# EAGLE design ai_hub_usb (EAGLE 8.3.0)
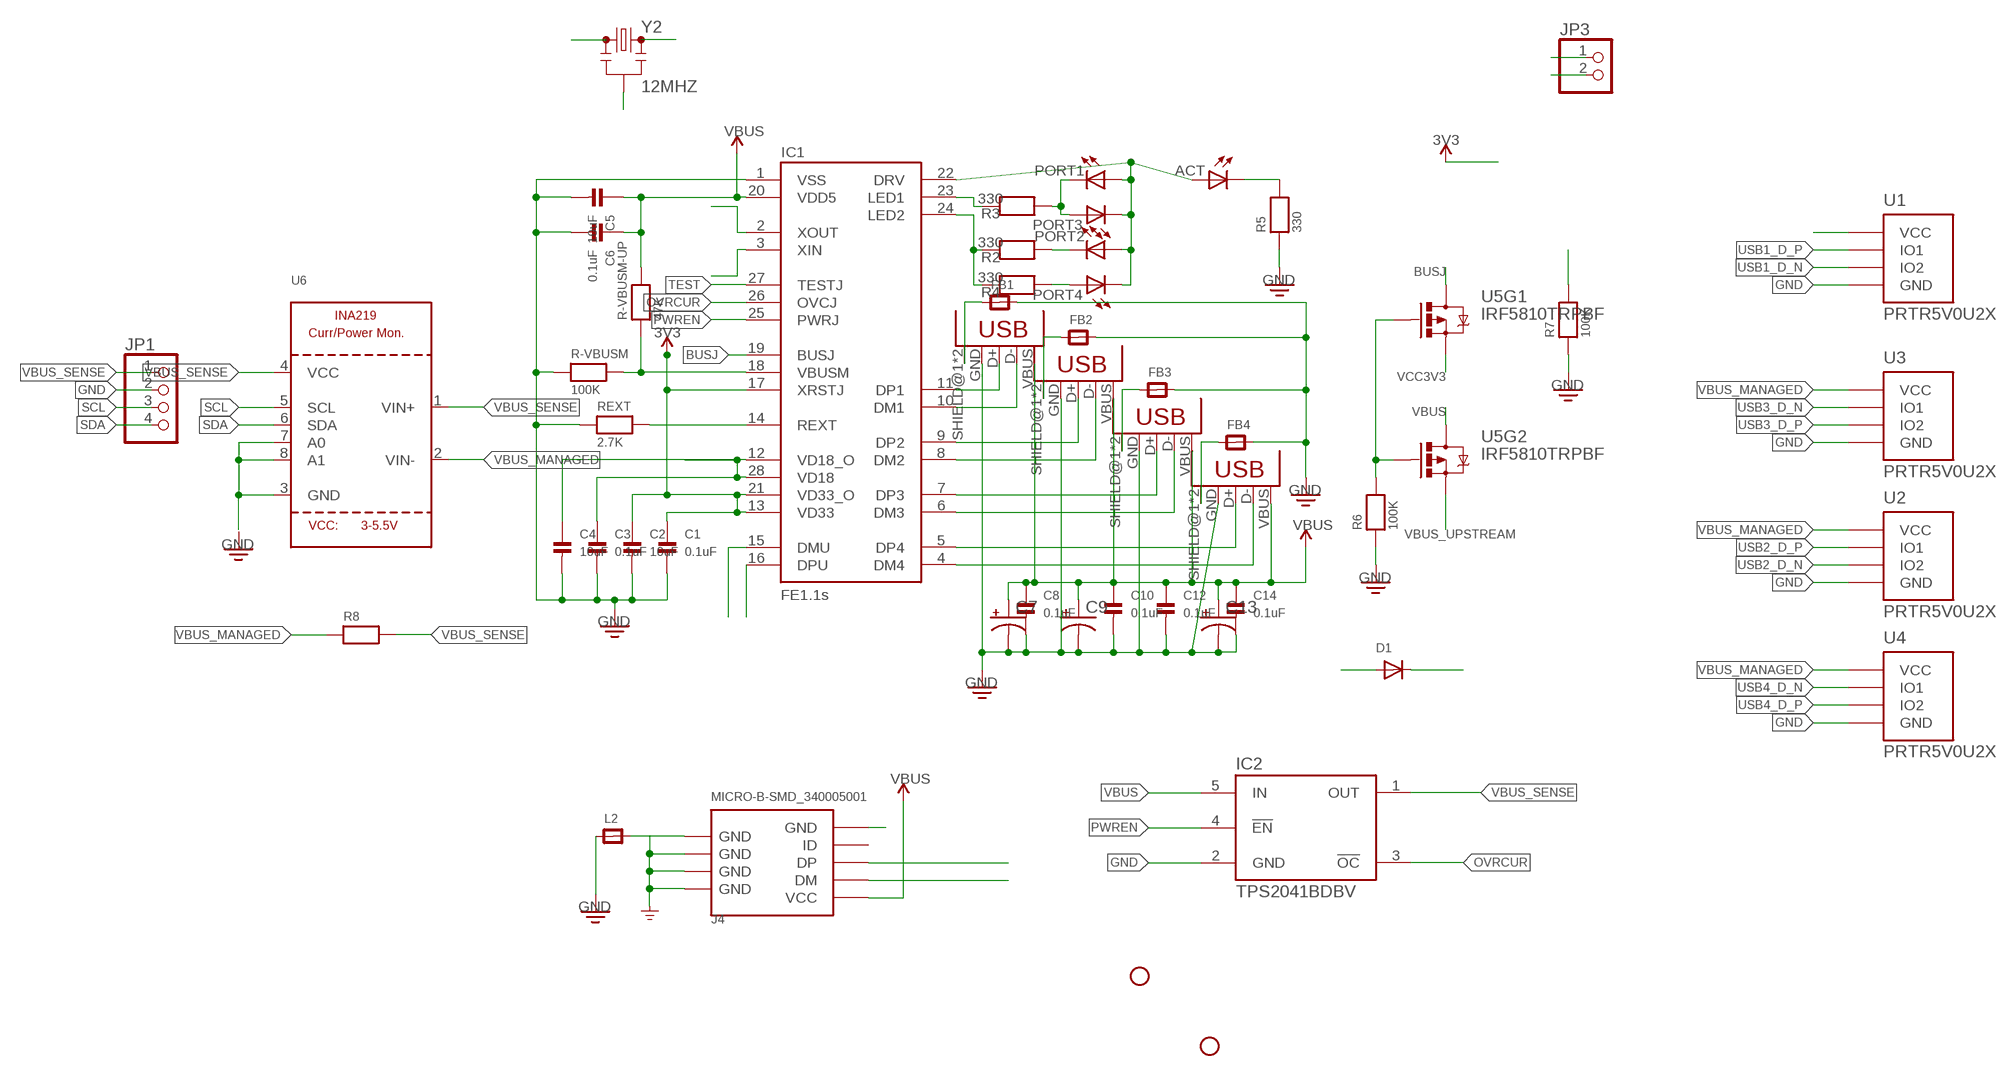
[diagram p0: schematic, sheet 1]

## Parts
ACT  LED0603  [LED-0603]
C1  0.1uF  CAP_CERAMIC_0603MP  [_0603MP]
C2  10uF  CAP_CERAMIC_0603MP  [_0603MP]
C3  0.1uF  CAP_CERAMIC_0603MP  [_0603MP]
C4  10uF  CAP_CERAMIC_0603MP  [_0603MP]
C5  10uF  CAP_CERAMIC_0603MP  [_0603MP]
C6  0.1uF  CAP_CERAMIC_0603MP  [_0603MP]
C7  CAP_POLD  [PANASONIC_D]
C8  0.1uF  CAP_CERAMIC_0603MP  [_0603MP]
C9  CAP_POLD  [PANASONIC_D]
C10  0.1uF  CAP_CERAMIC_0603MP  [_0603MP]
C12  0.1uF  CAP_CERAMIC_0603MP  [_0603MP]
C13  CAP_POLD  [PANASONIC_D]
C14  0.1uF  CAP_CERAMIC_0603MP  [_0603MP]
D1  DIODESMA  [SMADIODE]
FB1  FERRITE_0603MP  [_0603MP]
FB2  FERRITE_0603MP  [_0603MP]
FB3  FERRITE_0603MP  [_0603MP]
FB4  FERRITE_0603MP  [_0603MP]
IC1  FE1.1S  [FE1.1S_SSOP-28]
IC2  TPS2041BDBV  [SOT23-5L]
J4  MICRO-B-SMD_340005001  USB-MINIUSB-5P-MICRO  [MICRO-USB]
JP1  HEADER-1X4ROUND  [1X04_ROUND]
JP3  HEADER-1X2ROUND  [1X02_ROUND]
L2  FERRITE_0603MP  [_0603MP]
PORT1  LED0603  [LED-0603]
PORT2  LED0603  [LED-0603]
PORT3  LED0603  [LED-0603]
PORT4  LED0603  [LED-0603]
R2  330  RESISTOR_0603MP  [_0603MP]
R3  330  RESISTOR_0603MP  [_0603MP]
R4  330  RESISTOR_0603MP  [_0603MP]
R5  330  RESISTOR_0603MP  [_0603MP]
R6  100K  RESISTOR_0603MP  [_0603MP]
R7  100K  RESISTOR_0603MP  [_0603MP]
R8  RESISTOR1206  [1206]
R-VBUSM  100K  RESISTOR_0603MP  [_0603MP]
R-VBUSM-UP  47K  RESISTOR_0603MP  [_0603MP]
REXT  2.7K  RESISTOR_0603MP  [_0603MP]
STANDOFF1  STAND-OFF4  [STAND-OFF-4]
STANDOFF4  STAND-OFF4  [STAND-OFF-4]
U1  PRTR5V0U2X  [SOT-143B]
U2  PRTR5V0U2X  [SOT-143B]
U3  PRTR5V0U2X  [SOT-143B]
U4  PRTR5V0U2X  [SOT-143B]
U5  IRF5810TRPBF  MOSFET-PCHANNEL_DUALALT  [SOT23-6]
U6  INA219  [SOT23-8]
USB1  USBA-PTH-VERTICAL  [USB-A-F-PTH-VERTICAL]
USB2  USBA-PTH  [USB-A-F-PTH]
USB3  USBA-PTH-VERTICAL  [USB-A-F-PTH-VERTICAL]
USB4  USBA-PTH-VERTICAL  [USB-A-F-PTH-VERTICAL]
Y2  12MHZ  RESONATOR16MHZ  [RESONATOR-SMD]

## Nets
BUSJ: IC1.19(BUSJ) R7.2 U5.6(D)
DRV: ACT.A IC1.22(DRV) PORT1.A PORT2.A PORT3.C PORT4.C
GND: C1.2 C2.2 C3.2 C4.2 C5.2 C6.2 C7.- C8.2 C9.- C10.2 C12.2 C13.- C14.2 FB1.2 FB2.2 FB3.2 FB4.2 IC1.1(VSS) IC2.2(GND) J4.5(GND) JP1.2 JP3.2 L2.1 R5.1 R6.1 R7.1 R-VBUSM.1 REXT.1 U1.1(GND) U2.1(GND) U3.1(GND) U4.1(GND) U6.3(GND) U6.7(A0) U6.8(A1) USB1.GND USB2.GND USB3.GND USB4.GND Y2.2
LED1: IC1.23(LED1) R3.1
LED2: IC1.24(LED2) R2.1 R4.1
N$1: IC1.14(REXT) REXT.2
N$2: FB1.1 USB1.SHIELD@1(SHIELD) USB1.SHIELD@2(SHIELD)
N$3: FB2.1 USB2.SHIELD@1(SHIELD) USB2.SHIELD@2(SHIELD)
N$4: FB3.1 USB3.SHIELD@1(SHIELD) USB3.SHIELD@2(SHIELD)
N$5: FB4.1 USB4.SHIELD@1(SHIELD) USB4.SHIELD@2(SHIELD)
N$6: PORT2.C R2.2
N$7: PORT4.A R4.2
N$20: PORT1.C PORT3.A R3.2
N$22: ACT.C R5.2
OSC_IN: IC1.3(XIN) Y2.1
OSC_OUT: IC1.2(XOUT) Y2.3
OVRCUR: IC1.26(OVCJ) IC2.3(!OC)
PWREN: IC1.25(PWRJ) IC2.4(!EN)
SCL: JP1.3 U6.5(SCL)
SDA: JP1.4 U6.6(SDA)
TEST: IC1.27(TESTJ)
USB1_D_N: IC1.10(DM1) U1.3(IO2) USB1.D-
USB1_D_P: IC1.11(DP1) U1.2(IO1) USB1.D+
USB2_D_N: IC1.8(DM2) U2.3(IO2) USB2.D-
USB2_D_P: IC1.9(DP2) U2.2(IO1) USB2.D+
USB3_D_N: IC1.6(DM3) U3.2(IO1) USB3.D-
USB3_D_P: IC1.7(DP3) U3.3(IO2) USB3.D+
USB4_D_N: IC1.4(DM4) U4.2(IO1) USB4.D-
USB4_D_P: IC1.5(DP4) U4.3(IO2) USB4.D+
USB_D_N: IC1.15(DMU) J4.2(DM)
USB_D_P: IC1.16(DPU) J4.3(DP)
USB_SHIELD: J4.S1(GND) J4.S2(GND) J4.S3(GND) J4.S4(GND) J4.S5(GND) J4.S6(GND) L2.2
VBUS: C5.1 C6.1 D1.C IC1.20(VDD5) IC2.5(IN) R-VBUSM-UP.2 U5.4(D)
VBUS_MANAGED: C7.+ C8.1 C9.+ C10.1 C12.1 C13.+ C14.1 R8.1 U1.4(VCC) U2.4(VCC) U3.4(VCC) U4.4(VCC) U6.2(VIN-) USB1.VBUS USB2.VBUS USB3.VBUS USB4.VBUS ; supply symbol labelled VBUS
VBUS_MONITOR: IC1.18(VBUSM) R-VBUSM-UP.1 R-VBUSM.2
VBUS_SENSE: IC2.1(OUT) JP1.1 R8.2 U6.1(VIN+) U6.4(VCC)
VBUS_UPSTREAM: J4.1(VCC) U5.2(S) ; supply symbol labelled VBUS
VCC1V8: C3.1 C4.1 IC1.12(VD18_O) IC1.28(VD18)
VCC3V3: C1.1 C2.1 IC1.13(VD33) IC1.17(XRSTJ) IC1.21(VD33_O) U5.5(S) ; supply symbol labelled 3V3
VEXT: D1.A JP3.1 R6.2 U5.1(G) U5.3(G)
Unconnected: J4.4(ID)

## Library data of the parts
ACT PORT1-PORT4 = Ai_LED:LED
C1-C6 C8 C10 C12 C14 = microbuilder:CAP_CERAMIC: Ceramic Capacitors 0402 - 0402 Surface Mount Capacitors 16pF 50V 5% [Digikey: 445-4899-2-ND] 18pF 50V 5% [Digikey: 490-1281-2-ND] 22pF 50V 5% [Digikey: 490-1283-2-ND] 68pF 50V 5% [Digikey: 490-1289-2-ND] 0.1uF 10V 10% [Digikey: 490-1318-2-ND] 1.0uF 6.3V 10% [Digikey: 490-1320-2-ND] 0603 - 0603 Surface Mount Capacitors 16 pF 50V 5% [Digikey: 445-5051-2-ND] 22 pF 50V [Digikey: PCC220ACVTR-ND] 33 pF 50V 5% [Digikey: 490-1415-1-ND] 56pF 50V 5% [Digikey: 490-1421-1-ND] 220pF 50V 5% [Digikey: 445-1285-1-ND] 680 pF 50V 2200 pF 50V 5% C0G [Digikey: 445-1297-1-ND] 5600 pF 100V 5% X7R [Digikey: 478-3711-1-ND] 0.1 µF 25V 10% [Digikey: PCC2277TR-ND] 0.22 µF 16V 10% X7R [Digikey: 445-1318-1-ND] 1.0 µF 25V 10% [Digikey: 445-5146-2-ND] 0603 - RF Specific 3pF 250V +/-0.1pF RF [Digikey: 712-1347-1-ND] 18 pF 250V 5% [Digikey: 478-3505-1-ND or 712-1322-1-ND] 56 pF 250V 5% C0G RF [Digikey: 490-4867-1-ND] 68 pF 250V RF [Digikey: 490-4868-1-ND] 0805 - 0805 Surface Mount Capacitors 220 pF 250V 2% RF Ceramic Capacitor [Digikey: 712-1398-1-ND] 1000 pF 50V 2% NP0 Ceramic Capacitor [Digikey: 478-3760-1-ND] 0.1 µF 25V 10% Ceramic Capacitor [Digikey: PCC1828TR-ND] 1.0 µF 16V 10% Ceramic Capacitor[Digikey: 490-1691-2-ND] 10.0 µF 10V 10% Ceramic Capacitor[Digikey: 709-1228-1-ND] 10.0 uF 16V 10% Ceramic Capacitor [Digikey: 478-5165-2-ND] 47 uF 6.3V 20% Ceramic Capacitor [Digikey: 587-1779-1-ND or 399-5506-1-ND] 1206 - 1206 Surface Mount Capacitors 47uF 10V 20% Ceramic Capacitor [Digikey: 490-5528-1-ND or 399-5508-1-ND or 445-6010-1-ND] 100uF 6.3V -20%, +80% Y5V Ceramic Capacitor (Digikey: 490-4512-1-ND, Mouser: 81-GRM31CF50J107ZE1L)
C7 C9 C13 = SparkFun-Passives:CAP_POL: Capacitor Polarized These are standard SMD and PTH capacitors. Normally 10uF, 47uF, and 100uF in electrolytic and tantalum varieties. Always verify the external diameter of the through hole cap, it varies with capacity, voltage, and manufacturer. The EIA devices should be standard.
D1 = microbuilder:DIODE: Diode SMA Model Volts Amps Type Vf Vr Digikey # Notes SSA34-E3 40V 3A Schottky 480mV @ 3A 200uA @ 40V SSA34-E3/61TGITR-ND CDBA120-G 20V 1A Schottky 500mV @ 1A 500uA @ 20V 641-1014-6-ND REEL MBRA210 10V 2A Schottky 350mV @ 2A 700uA @ 10V MBRA210LT3 SOD-123 Model Volts Amps Type Vf Vr Order # Notes BAT54T1G 30V 200mA Schottky 800mV @ 200mA 2uA @ 25V BAT54T1GOSTR-ND B0530W 30V 500mA Schottky 430mV @ 500mA 130uA @ 30V B0530W-FDICT-ND REEL MBR120 1A 20V Schottky 340mV @ 1A MBR120VLSFT1GOSCT-ND SOD-323 Model Volts Amps Type Vf Vr Order # Notes PMEG2005EJ 20V 500mA Schottky 355mV @ 500mA 568-4110-1-ND ZLLS410 10V 570mA Schottky 380mV @ 570mA ZLLS410CT-ND 1N4148WS 75V 150mA Silicon/Simple 1V 1N4148WSFSCT-ND REEL SOD-523 Model Volts Amps Type Vf Vr Order # Notes BAT54XV2 30V 200mA Schottky 0.8V @ 100mA BAT54XV2CT-ND TB751S 30V 30mA Schottky RB751S-40TE61CT-ND SOT23-R/W (R = Solder Paste/Reflow Ovens, W = Hand-Soldering) Model Volts Amps Type Vf Vr Order # Notes BAT54FILM 40V 300mA Schottky 497-7162-1-ND
FB1-FB4 L2 = microbuilder:FERRITE: Ferrite Bead 0603 MMZ1608B121C - 120 Ohm @ 100MHz, 600mA, 0.15 Ohm DC Resistance - Digikey: 445-2164-1-ND BK1608HW121-T - 120 Ohm, 600mA Ferrite Chip - Digikey: 587-1876-2-ND 0805 HZ0805B272R-10 - 2.7K Ohm @ 100MHz, 200mA, 0.8 Ohm DC Resistance - Digikey: 240-2504-1-ND (see also Murata BLM21BD272SN1L) MMZ2012Y152B - 1.5K Ohm @ 100MHz, 500mA, 0.4 Ohm DC Resistance - Digikey: 445-1560-1-ND - Mainly for high frequency (80-400MHz) MMZ2012R102A - 1K Ohm @ 100MHz, 500mA, 0.3 Ohm DC Resistance - Digikey: 445-1555-2-ND - More general purpose (10-200MHz)
IC1 = Ai_IC:FE1.1S
IC2 = tps204xb_205xb:TPS2041BDBV
J4 = connectors:USB-MINIUSB-5P
JP1 = microbuilder:HEADER-1X4: PIN HEADER
JP3 = microbuilder:HEADER-1X2: PIN HEADER
R2-R8 R-VBUSM R-VBUSM-UP REXT = microbuilder:RESISTOR: Resistors 0402 - 0402 Surface Mount Package 22 Ohm 1% 1/16W [Digikey: 311-22.0LRTR-ND] 33 Ohm 5% 1/16W 1.0K 5% 1/16W 1.5K 5% 1/16W 2.0K 1% 1/16W 10.0K 1% 1/16W [Digikey: 311-10.0KLRTR-ND] 10.0K 5% 1/16W [Digikey: RMCF0402JT10K0TR-ND] 12.1K 1% 1/16W [Digikey: 311-22.0LRTR-ND] 100.0K 5% 1/16W 0603 - 0603 Surface Mount Package 0 Ohm 1/10 Watt 1% Resistor 15 Ohm 1/10 Watt 1% Resistor 33 Ohm 1/10 Watt 1% Resistor 49.9 Ohm 1/10 Watt 1% Resistor 100 Ohm 1/10 Watt 1% Resistor 150 Ohm 1/10 Watt 1% Resistor 240 Ohm 1/10 Watt 1% Resistor 390 Ohm 1/10 Watt 1% Resistor 560 Ohm 1/10 Watt 1% Resistor 680 Ohm 1/10 Watt 1% Resistor 750 Ohm 1/10 Watt 1% Resistor 1.0K Ohm 1/10 Watt 1% Resistor 1.5K Ohm 1/10 Watt 1% Resistor 2.0K Ohm 1/10 Watt 1% Resistor 2.2K Ohm 1/10 Watt 1% Resistor 3.3K Ohm 1/10 Watt 1% Resistor 4.7K Ohm 1/10 Watt 1% Resistor 10.0K Ohm 1/10 Watt 1% Resistor 12.0K Ohm 1/10 Watt 1% Resistor 12.1K Ohm 1/10 Watt 1% Resistor 20.0K Ohm 1/10 Watt 1% Resistor 33.0K Ohm 1/10 Watt 1% Resistor 100.0K Ohm 1/10 Watt 1% Resistor 0805 - 0805 Surface Mount Package 0 Ohm 1/8 Watt 1% Resistor 33 Ohm 1/8 Watt 1% Resistor 100 Ohm 1/8 Watt 1% Resistor 150 Ohm 1/8 Watt 1% Resistor 200 Ohm 1/8 Watt 1% Resistor 240 Ohm 1/8 Watt 1% Resistor 330 Ohm 1/8 Watt 1% Resistor 390 Ohm 1/8 Watt 1% Resistor 470 Ohm 1/8 Watt 1% Resistor 1.0K Ohm 1/8 Watt 1% Resistor 1.5K Ohm 1/8 Watt 1% Resistor 2.0K Ohm 1/8 Watt 1% Resistor 4.7K Ohm 1/8 Watt 1% Resistor 5.1K Ohm 1/8 Watt 1% Resistor 5.6K Ohm 1/8 Watt 1% Resistor 10.0K Ohm 1/8 Watt 1% Resistor 22.0K Ohm 1/8 Watt 1% Resistor 33.0K Ohm 1/8 Watt 1% Resistor 100K Ohm 1/8 Watt 1% Resistor 1206 - 1206 Surface Mount Package 2012 - 2010 Surface Mount Package 0.11 Ohm 1/2 Watt 1% Resistor - Digikey: RHM.11UCT-ND
STANDOFF1 STANDOFF4 = Ai_Electromechanical:STAND-OFF: Size #4
U1-U4 = esd:PRTR5V0U2X?: I2C-Bus EDS Protection Ulta low capacitance double rail-to-rail ESD protection diode Documentation Datasheet <http://www.nxp.com/documents/data_sheet/PRTR5V0U2X.pdf> General Description Ultra low capacitance rail-to-rail ElectroStatic Discharge (ESD) protection diode in a small SOT143B Surface-Mounted Device (SMD) plastic package designed to protect two Hi-Speed data lines or high-frequency signal lines from the damage caused by ESD and other transients. PRTR5V0U2X incorporates two pairs of ultra low capacitance rail-to-rail diodes as well as an additional ESD protection diode to ensure signal line protection even if no supply voltage is available. Features ESD protection of two Hi-Speed data lines or high-frequency signal lines Ultra low input/output to ground capacitance: C(I/O-GND) = 1 pF ESD protection up to 8kV IEC 61000-4-2, level 4 (ESD) Very low clamping voltage due to an integrated additional ESD protection diode Very low reverse current Small SMD plastic package Applications USB 2.0 ports Digital Video Interface (DVI)/High Definition Multimedia Interface (HDMI) interfaces Mobile and cordless phones Personal Digital Assistants (PDA) Digital Cameras Wide Area Network (WAN) / Local Area Network (LAN) systems PCs, notebooks, printers, and other PC peripherals; APPLICATIONS: General Purpose; BIDIRECTIONAL_CHANNELS: 2; CAPACITANCE: 1pF @ 1MHz; CURRENT_PEAK_PULSE: -; DESCRIPTION: TVS DIODE 5.5VWM SOT143B; DOCUMENTATION_LINK: <a href="http://www.nxp.com/documents/data_sheet/PRTR5V0U2X.pdf">Datasheet</a>; DOCUMENTATION_URL: http://www.nxp.com/documents/data_sheet/PRTR5V0U2X.pdf; MANUFACTURER: NXP Semiconductors; MOUNTING_TYPE: Surface Mount; OPERATING_TEMPERATURE: -40C ~ 85C; PART_NUMBER: PRTR5V0U2X,215; POWER-PEAK_PULSE: -; POWER_LINE_PROTECTION: Yes; SUPPLIER_ITEM_LINK: <a href="http://www.digikey.com/product-detail/en/PRTR5V0U2X,215/568-4140-1-ND/1589981">Details</a>; SUPPLIER_ITEM_NUMBER: 568-4140-1-ND; SUPPLIER_ITEM_URL: http://www.digikey.com/product-detail/en/PRTR5V0U2X,215/568-4140-1-ND/1589981; SUPPLIER_LINK: <a href="http://www.digikey.com">Home Page</a>; SUPPLIER_NAME: Digi-Key; SUPPLIER_URL: http://www.digikey.com; TYPE: Steering (Rail to Rail); UNIDIRECTIONAL_CHANNELS: -; VOLTAGE_BREAKDOWN: 6V; VOLTAGE_CLAMPING: -; VOLTAGE_REVERSE: 5.5V
U5 = SparkFun-DiscreteSemi:MOSFET-PCHANNEL_DUAL
U6 = microbuilder:INA219: INA219 - I2C Current/Power Monitor Voltage Range: 0-26V Accuracy: 0.5% Temperature: -40°C - 125°C
USB1-USB4 = ai_hub_usb:USB
Y2 = SparkFun-FreqCtrl:RESONATOR: Resonator Small SMD resonator. Used, eg, on the Arduino Pro/ Pro Mini boards. 8MHz- XTAL-08895 16MHz- XTAL-08900; PROD_ID: XTAL-08900; VALUE: 16MHZ

## Net classes
0 default: width 0.152 mm, drill 0.33 mm, clearance 0.152 mm

## Board
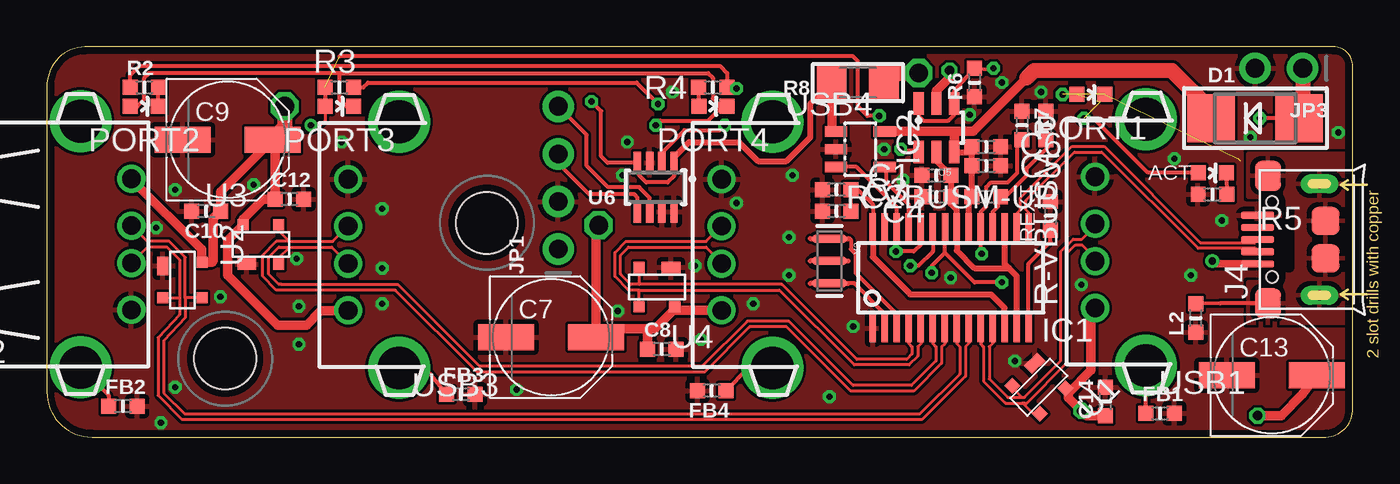
[diagram p1: board, top side]
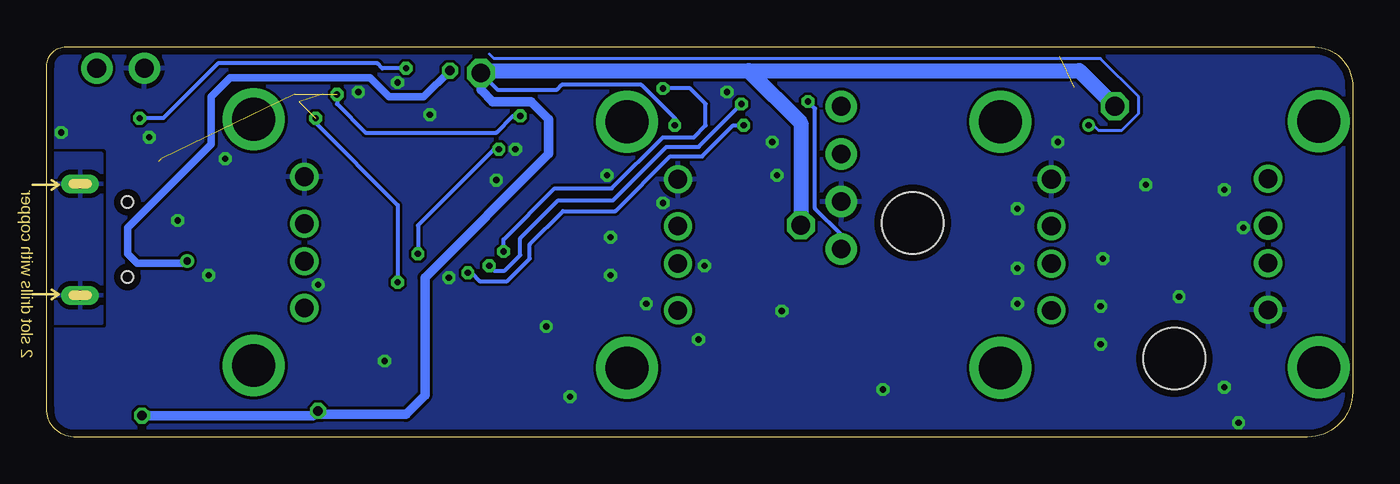
[diagram p2: board, bottom side, seen from below]

Size 69.72 x 20.83 mm. Coordinates in mm from the lower left corner, seen from the top.
Outline: 0,18.67 0,2.41 arc90 2.41,0 68.3,0 arc90 69.72,1.52 69.72,19.81 arc90 68.71,20.83 2.03,20.83 arc90 0,18.67
Copper layers (1*16): Top 0.0356mm / dielectric 1.5011mm / Bottom 0.0356mm
Design rules "oshpark-2layer": minimum track width 6mil, minimum drill 13mil, track to track 6mil, track to pad 6mil, pad to pad 6mil, via to via 6mil, smd to smd 6mil, copper to edge 15mil, drill to drill 6mil, minimum pad ring 7mil, minimum via ring 7mil, stop-mask expansion 2.5mil, vias tented up to drill 0mil, thermal gap 10mil

### Footprints (pad centres in the part's own frame; a part is rotated, then mirrored left to right if it is on the bottom)
LED-0603 = smd 0.8 x 0.8: A 0,-0.75; C 0,0.75
_0603MP = smd 0.8 x 0.8: 1 -0.762,0; 2 0.762,0
PANASONIC_D = smd 3 x 1.4: + 2.4,0; - -2.4,0
SMADIODE = smd 2.54 x 2.54: A 2.349,0; C -2.349,0
FE1.1S_SSOP-28 = smd 0.35 x 1.5: 1 -4.16,-2.7; 2 -3.52,-2.7; 3 -2.88,-2.7; 4 -2.24,-2.7; 5 -1.6,-2.7; 6 -0.96,-2.7; 7 -0.32,-2.7; 8 0.32,-2.7; 9 0.96,-2.7; 10 1.6,-2.7; 11 2.24,-2.7; 12 2.88,-2.7; 13 3.52,-2.7; 14 4.16,-2.7; 15 4.16,2.7; 16 3.52,2.7; 17 2.88,2.7; 18 2.24,2.7; 19 1.6,2.7; 20 0.96,2.7; 21 0.32,2.7; 22 -0.3,2.7; 23 -0.96,2.7; 24 -1.6,2.7; 25 -2.24,2.7; 26 -2.88,2.7; 27 -3.52,2.7; 28 -4.16,2.7
SOT23-5L = smd 0.55 x 1.2: 1 -0.95,-1.3; 2 0,-1.3; 3 0.95,-1.3; 4 0.95,1.3; 5 -0.95,1.3
MICRO-USB = smd 0.381 x 1.778: 1 -1.3,0.131; 2 -0.65,0.131; 3 0,0.131; 4 0.65,0.131; 5 1.3,0.131 | smd 1.6 x 1.397: S1 -3.4,-0.427; S6 3.4,-0.427 | drill 0.508 pad 1.016 long: S2 -2.972,-3.175; S5 2.972,-3.175 | smd 1.5 x 1.5: S3 -1,-3.5; S4 1,-3.5 | hole 0.635: -2,-0.65; 2,-0.65
1X04_ROUND = drill 1 pad 1.676: 1 -3.81,0; 2 -1.27,0; 3 1.27,0; 4 3.81,0
1X02_ROUND = drill 1 pad 1.676: 1 -1.27,0; 2 1.27,0
1206 = smd 1.6 x 1.8: 1 -1.4,0; 2 1.4,0
STAND-OFF-4 = hole 3.302: 0,0
SOT-143B = smd 1 x 0.6: 1 -0.75,-1.05 | smd 0.6 x 0.6: 2 0.95,-1.05; 3 0.95,1.05; 4 -0.95,1.05
SOT23-6 = smd 0.55 x 1.2: 1 0.95,-1.3; 2 0,-1.3; 3 -0.95,-1.3; 4 -0.95,1.3; 5 0,1.3; 6 0.95,1.3
SOT23-8 = smd 0.4 x 1.2: 1 -0.975,-1.3; 2 -0.325,-1.3; 3 0.325,-1.3; 4 0.975,-1.3; 5 0.975,1.3; 6 0.325,1.3; 7 -0.325,1.3; 8 -0.975,1.3
USB-A-F-PTH-VERTICAL = drill 1: D+ 0.974,2.07; D- -1.026,2.07; GND 3.474,2.07; VBUS -3.526,2.07 | drill 2.286: SHIELD@1 -6.596,-0.64; SHIELD@2 6.544,-0.64
USB-A-F-PTH = drill 1: D+ 1,5.37; D- -1,5.37; GND 3.5,5.37; VBUS -3.5,5.37 | drill 2.286: SHIELD@1 -6.57,2.66; SHIELD@2 6.57,2.66
RESONATOR-SMD = smd 0.45 x 1.905: 1 -1.2,0; 2 0,0; 3 1.2,0

### Placement (x,y rotation side)
ACT  62.23,14.1 270 top
C1  47.5,13.97 180 top
C2  47.5,12.83 180 top
C3  42.16,13.21 180 top
C4  42.16,12.07 180 top
C5  50.16,14.48 0 top
C6  50.16,15.49 0 top
C7  26.92,5.33 0 top
C8  32.83,4.7 0 top
C9  9.65,15.88 0 top
C10  8.51,12.07 180 top
C12  12.95,12.7 0 top
C13  65.41,3.3 0 top
C14  56.52,1.91 90 top
D1  64.52,17.02 0 top
FB1  59.44,1.27 0 top
FB2  4.06,1.65 0 top
FB3  22.1,2.29 0 top
FB4  35.5,2.48 180 top
IC1  48.26,8.51 0 top
IC2  43.43,15.37 270 top
J4  64.77,10.54 90 top
JP1  27.3,13.84 90 top
JP3  65.79,19.68 180 top
L2  61.34,6.35 90 top
PORT1  55.75,18.29 270 top
PORT2  5.21,17.65 270 top
PORT3  15.62,17.65 270 top
PORT4  35.56,17.65 270 top
R2  5.21,18.67 0 top
R3  15.62,18.67 180 top
R4  35.56,18.67 180 top
R5  62.23,12.95 0 top
R6  49.53,18.92 90 top
R7  52.07,16.64 270 top
R8  43.31,18.92 180 top
R-VBUSM  53.34,16.64 270 top
R-VBUSM-UP  50.16,12.83 180 top
REXT  53.59,11.81 270 top
STANDOFF1  9.53,4.19 0 top
STANDOFF4  23.5,11.43 0 top
U1  52.96,2.67 225 top
U2  7.24,8.38 270 top
U3  11.43,10.29 0 top
U4  32.58,8 180 top
U5  47.5,16.51 180 top
U6  32.51,13.34 180 top
USB1  58.04,10.41 90 top
USB2  -0.85,10.29 270 top
USB3  18.16,10.29 90 top
USB4  38.1,10.29 90 top
Y2  41.78,9.4 270 top

### Tracks (layer width: path | path; a pad name or v marks a point on that pad's centre or on a via)
BUSJ  (via drill 0.33)
  Top 0.203: U5.6 46.61,15.27 45.69,15.27 v45.59,15.37 | v49.91,9.78 49.86,9.83 IC1.19 49.86,12.01 50.16,12.32 50.16,13.34 50.42,13.59 51.31,13.59 51.82,14.1 51.82,15.62 R7.2
  Bottom 0.203: v45.59,15.37 45.85,15.37 49.91,11.3 v49.91,9.78
DRV  (via drill 0.33)  (2 unrouted)
  Top 0.203: 47.96,9.82 IC1.22 | 47.96,9.8 47.96,9.82 | v50.99,8.26 49.53,8.26 47.96,9.82 | 47.96,9.82 47.24,9.11 v47.24,8.76 | 55.24,17.02 v55.37,17.02 55.5,16.89 56.01,16.89 58.79,14.11 ACT.A | PORT2.A 4.83,17.65 5.21,18.03 5.21,19.18 5.46,19.43 15.64,19.43 | PORT3.C 16,17.65 15.62,18.03 15.62,19.41 15.64,19.43 | 15.64,19.43 35.31,19.43 35.56,19.18 35.56,18.08 35.98,17.66 | v32.51,16.64 32.77,16.89 35.31,16.89 35.94,17.53 35.97,17.53 35.98,17.66 | 36.1,17.55 36.06,17.53 | 35.98,17.66 36.1,17.55 | PORT4.C 36.2,17.65 36.1,17.55
  Bottom 0.203: v47.24,8.76 47.05,8.76 46.61,8.32 45.15,8.32 43.94,9.53 43.94,10.29 42.16,12.07 39.37,12.07 36.45,14.99 34.73,14.99 33.08,16.64 v32.51,16.64 | v50.99,8.26 50.99,12.38 55.37,16.76 v55.37,17.02
GND  (via drill 0.33)
  other vias: 48.26,8.51 43.05,5.91 55.24,8.13 36.83,12.5 53.09,18.42 50.99,18.92 37.72,7.11 15.75,15.75 11.05,13.46 6.86,13.21 13.46,4.95 17.91,12.19 17.91,9.02 17.91,7.11 6.1,0.76 41.78,2.16 39.62,8.64 39.62,10.67 45.72,13.72 51.69,4.06 25.08,2.54 39.81,13.97 30.99,15.75 34.61,9.14 30.48,6.73 13.46,6.98 13.34,9.53 9.27,7.49 49.28,17.21 30.73,13.97 61.09,8.64 68.96,16.26 62.74,11.56 60.2,14.86 64.26,16 33.4,18.42 44.7,15.37 34.92,5.21 5.84,11.18 6.86,2.67
  pour Bottom (rank 5): 0.25,-0.38 69.85,-0.25 70.1,21.21 0.13,20.83
  pour Top (rank 5): 0.25,-0.38 69.85,-0.25 70.1,21.21 0.13,20.83
LED1  (via drill 0.33)
  Top 0.203: IC1.23 47.3,9.9 46.55,9.14 v46.1,9.14 | R3.1 16.89,18.67 17.14,18.92 31.5,18.92 v32.64,17.78
  Bottom 0.203: v46.1,9.14 45.85,8.89 45.28,8.89 44.45,9.72 44.45,10.61 42.42,12.64 39.5,12.64 36.64,15.49 34.92,15.49 v32.64,17.78
LED2  (via drill 0.33)
  Top 0.203: IC1.24 46.66,10.27 46.29,9.91 v45.34,9.91 | R2.1 4.44,19.3 4.95,19.81 35.94,19.81 36.32,19.43 R4.1 v36.83,18.61
  Bottom 0.203: v45.34,9.91 45.34,10.54 42.61,13.27 39.56,13.27 36.83,16 35.18,16 34.54,16.64 34.54,17.78 35.37,18.61 v36.83,18.61
N$1
  Top 0.203: IC1.14 52.42,9.24 53.59,10.41 REXT.2
N$2
  Top 0.203: FB1.1 58.69,3.81 USB1.SHIELD@1
N$3
  Top 0.203: USB2.SHIELD@2 3.3,2.22 FB2.1
N$4
  Top 0.203: FB3.1 20.2,3.69 USB3.SHIELD@1
N$5
  Top 0.203: FB4.1 37.47,3.69 USB4.SHIELD@1
N$6
  Top 0.203: PORT2.C R2.2
N$7
  Top 0.203: R4.2 34.8,17.67 PORT4.A
N$20  (via drill 0.33, 0.35)  (4 unrouted)
  Top 0.152: PORT3.A 14.87,16.9 14.61,16.64 v14.1,16.64
  Top 0.203: PORT3.A 14.87,18.66 R3.2 | v44.45,17.15 43.81,17.15 43.31,17.65 43.31,20.07 43.04,20.33 15.63,20.33 15.62,20.32
  Bottom 0.152: v14.1,16.64 13.84,16.64 13.59,16.38 12.32,16.38 11.43,17.27 11.43,18.16 13.46,20.19 45.85,20.19 46.1,20.45
  Bottom 0.203: v54.23,18.29 54.23,17.78 52.7,16.26 45.72,16.26 44.83,17.14 v44.45,17.14 v44.45,17.15
N$22
  Top 0.203: ACT.C 62.98,13.96 R5.2
OSC_IN
  Top 0.203: IC1.3 45.38,6.56 43.18,8.76 43.18,9.78 42.93,10.03 42.93,10.54 42.87,10.6 42.8,10.6
OSC_OUT
  Top 0.203: IC1.2 44.74,6.57 43.11,8.2 42.8,8.2
OVRCUR
  Top 0.203: IC1.26 45.38,12.28 43.24,14.42 IC2.3
PWREN
  Top 0.203: IC1.25 46.02,12.4 44.83,13.59 44.83,14.32 IC2.4
SCL
  Top 0.203: U6.5 31.54,12.79 31.37,12.95 28.96,12.95 27.3,14.61 JP1.3
SDA
  Top 0.203: U6.6 32.19,12.77 31.62,13.34 29.97,13.34 28.83,14.48 28.83,16.13 JP1.4
USB1_D_N
  Top 0.152: IC1.10 49.86,4.98 50.01,4.83 50.01,2.98 51.18,1.82 52.07,1.82 | 52.07,1.82 52.2,1.82 | USB1.D- 55.69,9.67 55.69,9.84 55.27,10.26 54.93,10.26 54.45,9.78 54.45,3.94 52.32,1.82 52.2,1.82 | U1.3 52.68,1.25 52.11,1.82 | 52.2,1.82 | 52.2,1.82 | 52.2,1.82 52.11,1.82 | 52.11,1.82 52.09,1.82 | 52.07,1.82 52.11,1.82 | 52.11,1.82
USB1_D_P
  Top 0.152: IC1.11 50.5,5.01 50.32,4.83 50.32,3.11 51.31,2.12 52.07,2.12 | 52.07,2.12 52.2,2.12 54.14,4.06 54.14,9.91 54.8,10.57 55.27,10.57 55.63,10.92 55.63,11.05 USB1.D+ | U1.2 51.55,2.65 52.07,2.12
USB2_D_N
  Top 0.152: IC1.8 48.58,4.99 48.74,4.83 48.74,3.37 46.61,1.23 7.37,1.23 6.25,2.35 6.25,5.14 7.39,6.38 7.39,7.4 | USB2.D- 5.36,10.44 6.54,10.44 7.39,9.59 7.39,7.4 | U2.3 7.42,7.43 7.39,7.4
USB2_D_P
  Top 0.152: IC1.9 49.22,5 49.05,4.83 49.05,3.24 46.74,0.93 7.24,0.93 5.94,2.22 5.94,5.31 7.09,6.54 7.09,7.37 | USB2.D+ 5.36,10.14 6.41,10.14 7.09,9.46 7.09,7.37 | U2.2 7.02,7.43 7.09,7.37
USB3_D_N
  Top 0.152: IC1.6 47.3,5 47.47,4.83 47.47,4.06 46.16,2.76 43.05,2.76 39.62,6.19 37.4,6.19 34.99,3.77 23.11,3.77 18.73,8.15 12.51,8.15 | 12.51,8.15 12.38,8.15 11.84,8.7 11.84,9.59 12.38,10.14 12.95,10.14 | 12.95,10.14 15.22,10.14 USB3.D- | 12.51,8.16 12.51,8.15 | U3.2 12.38,9.56 12.95,10.14
USB3_D_P
  Top 0.152: IC1.7 47.94,4.99 47.78,4.83 47.78,3.94 46.29,2.45 42.93,2.45 39.5,5.88 37.53,5.88 35.12,3.47 22.99,3.47 18.61,7.85 12.51,7.85 | 12.51,7.85 12.26,7.85 11.53,8.57 11.53,9.71 12.26,10.44 12.95,10.44 | 12.95,10.44 15.27,10.44 USB3.D+ | 12.51,7.85 | U3.3 12.38,11.01 12.95,10.44
USB4_D_N
  Top 0.152: IC1.4 46.02,5.01 46.2,4.83 46.2,4.45 45.91,4.15 43.24,4.15 39.24,8.15 31.62,8.15 | 31.62,8.15 31.18,8.15 30.63,8.7 30.63,9.72 31.05,10.14 35.2,10.14 35.69,9.65 35.69,9.6 USB4.D- | U4.2 31.63,8.16 31.62,8.15
USB4_D_P
  Top 0.152: IC1.5 46.66,4.98 46.51,4.83 46.51,4.32 46.04,3.85 43.12,3.85 39.12,7.85 31.62,7.85 | 31.62,7.85 31.05,7.85 30.33,8.57 30.33,9.84 30.92,10.44 35.21,10.44 USB4.D+ | U4.3 31.63,7.84 31.62,7.85
USB_D_N
  Top 0.152: IC1.15 52.42,11.99 52.29,12.13 52.29,12.64 54.86,15.21 56.33,15.21 61.47,10.07 64.52,10.07 64.64,9.95 J4.2
USB_D_P
  Top 0.152: IC1.16 51.78,11.93 51.98,12.13 51.98,12.76 54.74,15.52 56.45,15.52 61.59,10.38 64.52,10.38 64.52,10.42 J4.3
USB_SHIELD
  Top 0.203: J4.S1 62.64,7.14 L2.2
  pour Top (isolate 0.254, rank 2): 69.47,15.11 64.14,15.11 64.14,12.83 65.02,12.83 65.79,12.07 65.79,9.02 65.02,8.26 64.14,8.26 64.14,6.1 69.47,6.1
  pour Bottom (isolate 0.254, rank 2): 66.8,15.11 69.47,15.11 69.47,6.1 66.8,6.1
VBUS
  Top 0.33: IC1.20 49.22,12.64 R-VBUSM-UP.2 C5.1 C6.1 49.31,15.21 U5.4
  Top 0.508: IC2.5 48.26,16.32 | 48.26,16.32 49.46,16.32 52.32,19.18 | U5.4 48.45,16.13 48.26,16.32
  Top 0.813: D1.C 62.17,17.46 60.07,19.56 52.7,19.56 52.32,19.18
VBUS_MANAGED  (via drill 0.33, 0.5, 1)
  Top 0.203: U6.2 32.84,15.18 34.04,16.38 35.94,16.38 v36.2,16.64
  Top 0.508: 33.46,6.76 USB4.VBUS | USB3.VBUS 16.06,6.73 14.63,6.73 13.87,5.97 12.32,5.97 9.65,8.64 9.65,10.51 U3.4 10.48,11.62 11.56,12.7 C12.1 12.19,15.74 C9.+ 9.27,13.09 C10.1 8.89,11.68 8.89,9.4 8.82,9.33 U2.4 8.25,9.37 8.25,10.03 4.52,13.77 USB2.VBUS | USB1.VBUS 55.75,6.67 55.75,3.56 54.54,2.34 | 54.54,2.34 U1.4 | 54.54,2.34 54.54,2.1 v55.24,1.4 55.5,1.14 C14.1 | U4.4 33.46,6.76 | 33.46,6.76 32.48,5.78 32.14,5.78 | 32.14,5.78 30.28,5.78 C7.+ 29.32,11.04 v29.46,11.3 | C8.1 32.07,5.71 32.14,5.78 | C13.+ 67.04,2.27 65.91,1.14 v64.64,1.14
  Top 0.813: R8.1 44.71,19.18 44.96,19.43 v46.55,19.43 | v12.7,17.65 12.7,16.52 C9.+
  Bottom 0.203: v46.55,19.43 45.66,18.54 42.48,18.54 42.23,18.8 37.97,18.8 36.2,17.02 v36.2,16.64
  Bottom 0.508: v46.55,19.43 46.55,18.54 45.91,17.91 43.88,17.91 42.93,16.95 42.93,15.11 49.53,8.51 49.53,2.23 50.55,1.21 55.06,1.21 v55.24,1.4 55.5,1.14 v64.64,1.14
  Bottom 0.813: v46.55,19.43 46.61,19.3 46.36,19.56 32.26,19.56 | 32.26,19.56 29.46,16.76 v29.46,11.3 | 32.26,19.56 14.61,19.56 v12.7,17.65
VBUS_MONITOR
  Top 0.203: IC1.18 50.5,12.02 50.8,12.32 50.8,12.7 R-VBUSM-UP.1 51.18,12.83 52.32,13.97 52.32,14.35 53.47,15.49 R-VBUSM.2
VBUS_SENSE  (via drill 0.33)
  Top 0.203: R8.2 41.66,18.92 41.27,18.54 | 33.53,14.68 U6.1 33.49,13.93 33.15,13.59 32,13.59 31.62,13.97 31.62,14.55 U6.4 29.94,14.64 29.59,14.99 29.59,17.4 v29.08,17.91
  Top 0.33: U6.1 33.49,14.95 34.29,15.75 36.96,15.75 37.97,14.73 39.5,14.73 40.77,16 40.77,17.78 R8.2
  Top 0.508: IC2.1 41.91,16.54 R8.2
  Bottom 0.203: JP1.1 27.3,10.8 28.7,12.19 28.7,17.53 v29.08,17.91
VBUS_UPSTREAM  (via drill 0.38, 0.5)
  Top 0.406: J4.1 62.33,9.24 v62.23,9.4
  Top 0.508: U5.2 47.5,18.48 48.2,19.18 v48.2,19.56
  Bottom 0.406: v62.23,9.4 62.36,9.27 64.9,9.27 65.41,9.78 65.41,11.18 60.96,15.62 60.96,18.16 59.94,19.18 52.45,19.18 51.44,18.16 49.59,18.16 v48.2,19.56
VCC1V8
  Top 0.203: C4.1 C3.1 43.31,13.21 44.1,12.41 IC1.28
  Top 0.33: IC1.28 44.1,9.62 46.1,7.62 50.42,7.62 51.14,6.9 IC1.12
VCC3V3
  Top 0.33: U5.5 47.5,14.73 C1.1 C2.1 48.26,12.45 48.58,12.13 IC1.21 48.58,9.97 49.53,9.02 51.37,9.02 51.78,8.61 | 51.78,8.61 IC1.13 | IC1.17 51.14,9.25 51.78,8.61
VEXT  (via drill 0.33)
  Top 0.203: 46.45,17.91 U5.1 | U5.3 48.45,17.85 48.39,17.91 | U5.1 46.61,17.87 | U5.1 46.55,17.14 46.8,16.89 48.13,16.89 48.45,17.21 48.45,17.84 | 48.45,17.84 48.51,17.91 | U5.3 48.45,17.84 | U5.3 48.45,18.48 R6.2 50.42,19.62 v50.55,19.68 | v64.77,17.02 66.76,17.02 D1.A
  Top 0.813: JP3.1 67.06,17.32 66.76,17.02
  Bottom 0.203: v50.55,19.68 51.82,19.68 52.07,19.94 60.58,19.94 63.5,17.02 v64.77,17.02